# Altium project PCB_LPF.PrjPCB
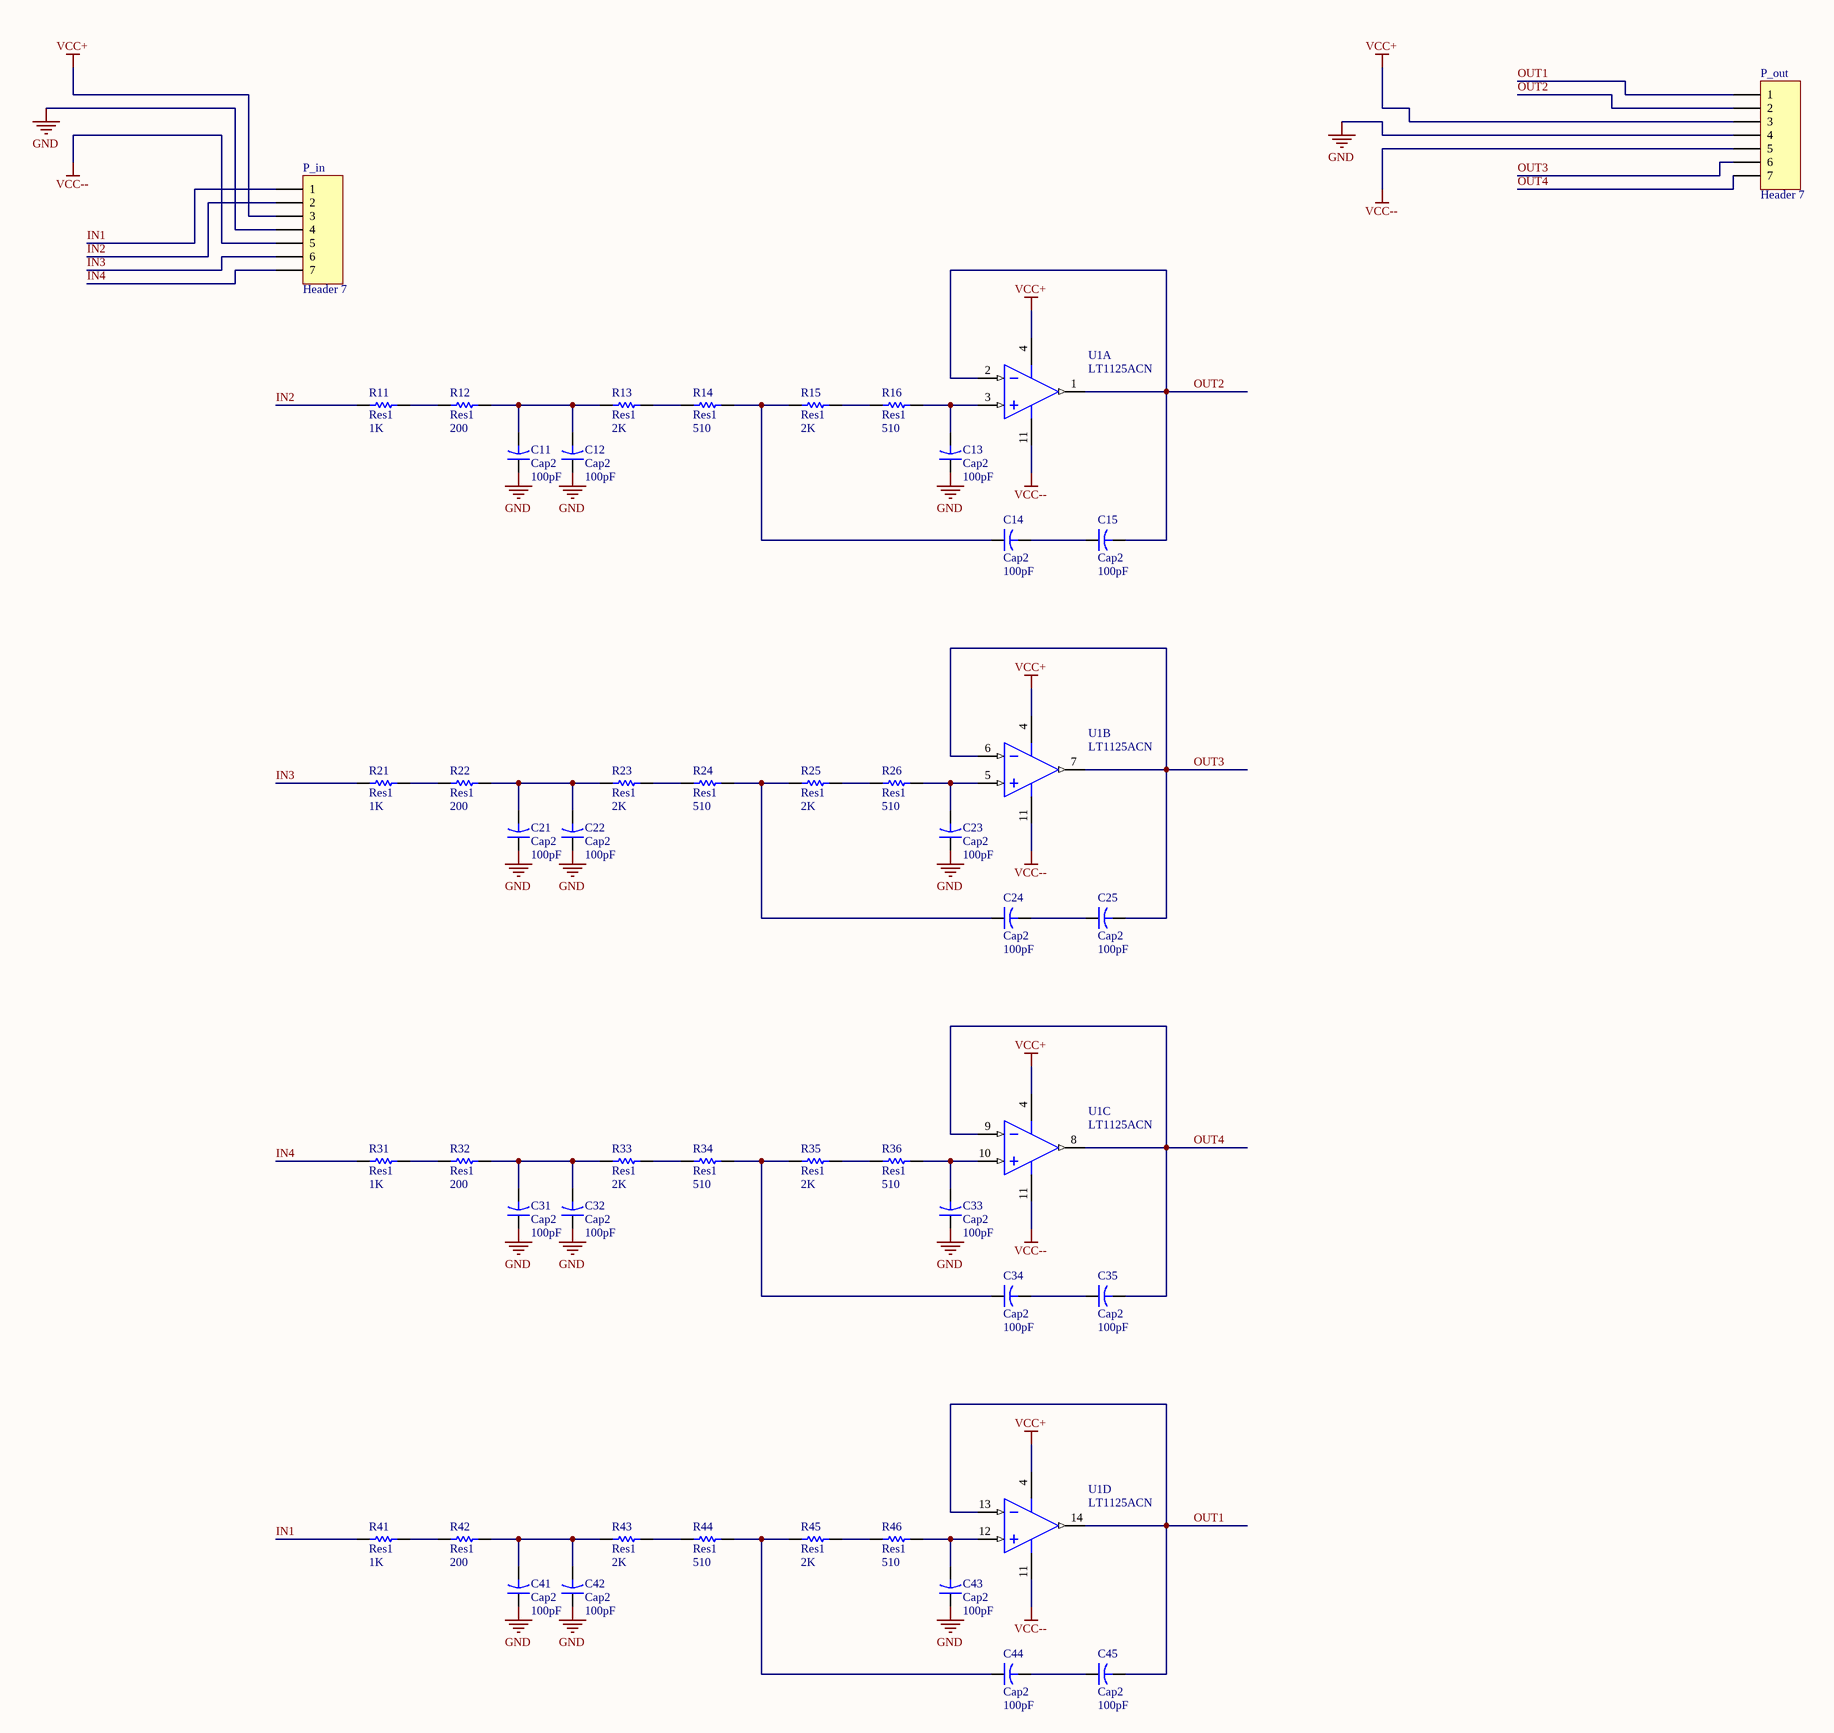
[diagram p0: lpf.SchDoc]
1 sheet, 47 parts. Net scope: global (net labels, ports and power ports of the same name join across sheets).
Board file: lpf.PcbDoc

## Sheet lpf.SchDoc
size A2

### Parts
C11  Cap2  value 100pF  [CAPR5-4X5]
C12  Cap2  value 100pF  [CAPR5-4X5]
C13  Cap2  value 100pF  [CAPR5-4X5]
C14  Cap2  value 100pF  [CAPR5-4X5]
C15  Cap2  value 100pF  [CAPR5-4X5]
C21  Cap2  value 100pF  [CAPR5-4X5]
C22  Cap2  value 100pF  [CAPR5-4X5]
C23  Cap2  value 100pF  [CAPR5-4X5]
C24  Cap2  value 100pF  [CAPR5-4X5]
C25  Cap2  value 100pF  [CAPR5-4X5]
C31  Cap2  value 100pF  [CAPR5-4X5]
C32  Cap2  value 100pF  [CAPR5-4X5]
C33  Cap2  value 100pF  [CAPR5-4X5]
C34  Cap2  value 100pF  [CAPR5-4X5]
C35  Cap2  value 100pF  [CAPR5-4X5]
C41  Cap2  value 100pF  [CAPR5-4X5]
C42  Cap2  value 100pF  [CAPR5-4X5]
C43  Cap2  value 100pF  [CAPR5-4X5]
C44  Cap2  value 100pF  [CAPR5-4X5]
C45  Cap2  value 100pF  [CAPR5-4X5]
P_in  Header 7  [HDR1X7]
P_out  Header 7  [HDR1X7]
R11  Res1  value 1K  [AXIAL-0.3]
R12  Res1  value 200  [AXIAL-0.3]
R13  Res1  value 2K  [AXIAL-0.3]
R14  Res1  value 510  [AXIAL-0.3]
R15  Res1  value 2K  [AXIAL-0.3]
R16  Res1  value 510  [AXIAL-0.3]
R21  Res1  value 1K  [AXIAL-0.3]
R22  Res1  value 200  [AXIAL-0.3]
R23  Res1  value 2K  [AXIAL-0.3]
R24  Res1  value 510  [AXIAL-0.3]
R25  Res1  value 2K  [AXIAL-0.3]
R26  Res1  value 510  [AXIAL-0.3]
R31  Res1  value 1K  [AXIAL-0.3]
R32  Res1  value 200  [AXIAL-0.3]
R33  Res1  value 2K  [AXIAL-0.3]
R34  Res1  value 510  [AXIAL-0.3]
R35  Res1  value 2K  [AXIAL-0.3]
R36  Res1  value 510  [AXIAL-0.3]
R41  Res1  value 1K  [AXIAL-0.3]
R42  Res1  value 200  [AXIAL-0.3]
R43  Res1  value 2K  [AXIAL-0.3]
R44  Res1  value 510  [AXIAL-0.3]
R45  Res1  value 2K  [AXIAL-0.3]
R46  Res1  value 510  [AXIAL-0.3]
U1  LT1125ACN  [LT-N-14]  (parts A,B,C,D of 4)

### Nets
GND: C11.1 C12.1 C13.1 C21.1 C22.1 C23.1 C31.1 C32.1 C33.1 C41.1 C42.1 C43.1 P_in.4 P_out.4
VCC+: P_in.3 P_out.3 U1.4(V+)
VCC--: P_in.5 P_out.5 U1.11(V-)
IN1: P_in.1 R41.1
IN2: P_in.2 R11.1
IN3: P_in.6 R21.1
IN4: P_in.7 R31.1
OUT1: C45.2 P_out.1 U1.13(-IND) U1.14(OUTD)
OUT2: C15.2 P_out.2 U1.1(OUTA) U1.2(-INA)
OUT3: C25.2 P_out.6 U1.6(-INB) U1.7(OUTB)
OUT4: C35.2 P_out.7 U1.8(OUTC) U1.9(-INC)
NetC11_2: C11.2 C12.2 R12.2 R13.1
NetC13_2: C13.2 R16.2 U1.3(+INA)
NetC14_1: C14.1 R14.2 R15.1
NetC14_2: C14.2 C15.1
NetC21_2: C21.2 C22.2 R22.2 R23.1
NetC23_2: C23.2 R26.2 U1.5(+INB)
NetC24_1: C24.1 R24.2 R25.1
NetC24_2: C24.2 C25.1
NetC31_2: C31.2 C32.2 R32.2 R33.1
NetC33_2: C33.2 R36.2 U1.10(+INC)
NetC34_1: C34.1 R34.2 R35.1
NetC34_2: C34.2 C35.1
NetC41_2: C41.2 C42.2 R42.2 R43.1
NetC43_2: C43.2 R46.2 U1.12(+IND)
NetC44_1: C44.1 R44.2 R45.1
NetC44_2: C44.2 C45.1
NetR11_2: R11.2 R12.1
NetR13_2: R13.2 R14.1
NetR15_2: R15.2 R16.1
NetR21_2: R21.2 R22.1
NetR23_2: R23.2 R24.1
NetR25_2: R25.2 R26.1
NetR31_2: R31.2 R32.1
NetR33_2: R33.2 R34.1
NetR35_2: R35.2 R36.1
NetR41_2: R41.2 R42.1
NetR43_2: R43.2 R44.1
NetR45_2: R45.2 R46.1

### Library data of the parts
C11-C15 C21-C25 C31-C35 C41-C45 = Cap2: Capacitor; Published: 23-Sep-2002; PackageReference: CAPR5-4X5; Publisher: Altium Limited; PackageDescription: Capacitor; 2 Leads
P_in P_out = Header 7: Header, 7-Pin; LatestRevisionDate: 17-Jul-2002; LatestRevisionNote: Re-released for DXP Platform.; Publisher: Altium Limited
R11-R16 R21-R26 R31-R36 R41-R46 = Res1: Resistor; Published: 8-Jun-2000; LatestRevisionDate: 17-Jul-2002; LatestRevisionNote: Re-released for DXP Platform.; PackageReference: AXIAL-0.3; Publisher: Altium Limited; PackageDescription: Axial Device, Thru-Hole; 2 Leads; 0.3 in Pin Spacing
U1 = LT1125ACN: Quad Channel, Low Noise Precision Operational Amplifier, Low 1/f Corner, 12.5 MHz Typical GBW, 4.5 V/us Typical SR, 8 to 44 V, 14-Pin DIP (N-14), Commercial; Linear Technology Part Number: LT1125; Manufacturer: Linear Technology; Channels (#): 4; GBW (MHz) Typical: 12.5; Is (mA) Typical: 2.3; SR (V/us) Typical: 4.5; Vos (mV) Typical: 0.025; Vs Max (V): 44; Vs Min (V): 8; DatasheetVersion: Rev. E; PackageVersion: Rev I; PackageReference: LT-N-14; PackageDescription: 14-Lead PDIP, Body 19.558 x 6.477 mm, Pitch 2.54 mm; Supplier 1: Digi-Key; Supplier Part Number 1: LT1125ACN-ND; Supplier 2: Newark; Supplier Part Number 2: 57M2021; Type: VFB; Mounting Technology: Through Hole; PartNumber: LT1125ACN; ComponentLink1Description: Manufacturer URL; ComponentLink1URL: http://www.linear.com/; ComponentLink2Description: Datasheet; ComponentLink2URL: http://cds.linear.com/docs/en/datasheet/11245fe.pdf; ComponentLink3Description: Package Specification; ComponentLink3URL: http://cds.linear.com/docs/en/packaging/05081510_I_N14.pdf